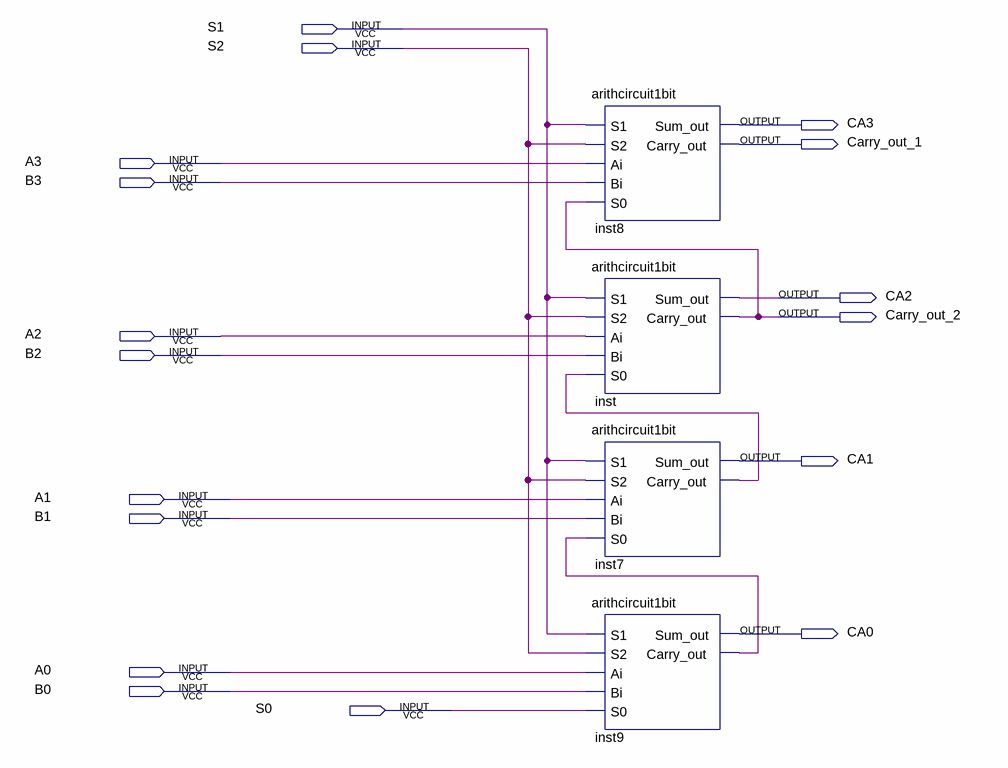
[diagram p0: schematic sheet]
// Quartus schematic arithcircuit4bits.bdf as structural Verilog: 4 symbols, 17 pins
module arithcircuit4bits (
  input  S1,
  input  S2,
  input  A3,
  input  B3,
  input  A2,
  input  B2,
  input  A1,
  input  B1,
  input  A0,
  input  B0,
  input  S0,
  output CA3,
  output Carry_out_1,
  output CA2,
  output Carry_out_2,
  output CA1,
  output CA0
);

  wire inst7_carry_out, inst9_carry_out;

  arithcircuit1bit inst8 (.S1(S1), .S2(S2), .Ai(A3), .Bi(B3), .S0(Carry_out_2), .Sum_out(CA3), .Carry_out(Carry_out_1));
  arithcircuit1bit inst (
    .S1(S1), .S2(S2), .Ai(A2), .Bi(B2), .S0(inst7_carry_out), .Sum_out(CA2), .Carry_out(Carry_out_2));
  arithcircuit1bit inst7 (
    .S1(S1), .S2(S2), .Ai(A1), .Bi(B1), .S0(inst9_carry_out), .Sum_out(CA1), .Carry_out(inst7_carry_out));
  arithcircuit1bit inst9 (.S1(S1), .S2(S2), .Ai(A0), .Bi(B0), .S0(S0), .Sum_out(CA0), .Carry_out(inst9_carry_out));
endmodule
